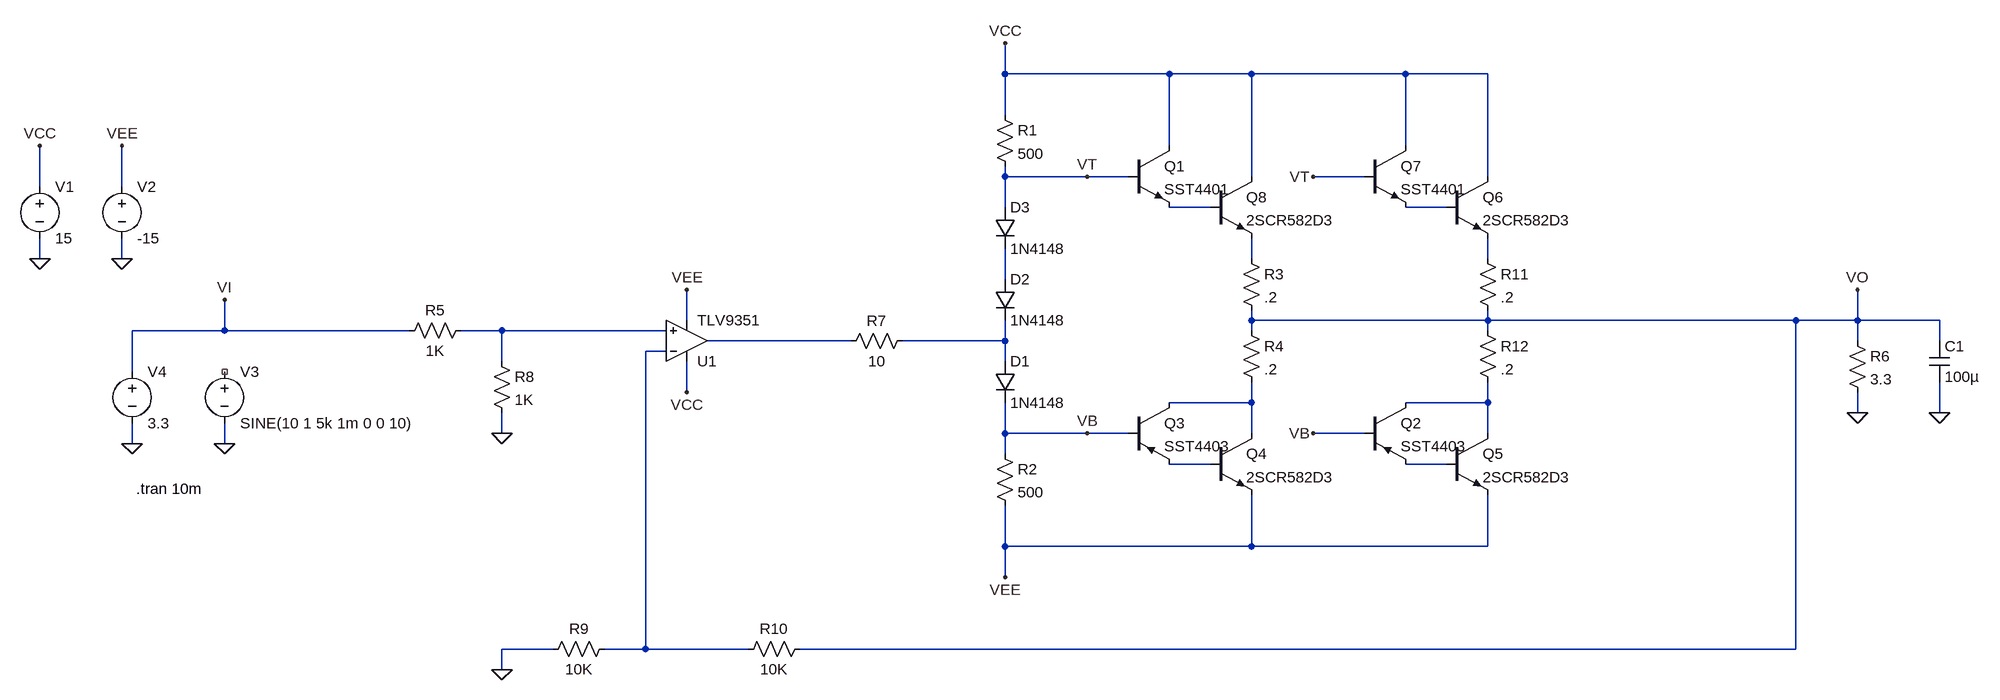
[diagram p0: schematic NOT_USED_Current Amp-PowerAmp.asc]
NOT_USED_Current Amp-PowerAmp.asc, the LTspice schematic file:
Version 4
SHEET 1 2168 740
WIRE 640 -208 640 -256
WIRE 896 -208 640 -208
WIRE 1024 -208 896 -208
WIRE 1264 -208 1024 -208
WIRE 1392 -208 1264 -208
WIRE 640 -144 640 -208
WIRE 896 -96 896 -208
WIRE 1264 -96 1264 -208
WIRE 640 -48 640 -64
WIRE 768 -48 640 -48
WIRE 832 -48 768 -48
WIRE 1024 -48 1024 -208
WIRE 1200 -48 1120 -48
WIRE 1392 -48 1392 -208
WIRE -864 -32 -864 -96
WIRE -736 -32 -736 -96
WIRE 640 0 640 -48
WIRE 960 0 896 0
WIRE 1328 0 1264 0
WIRE -864 80 -864 48
WIRE -736 80 -736 48
WIRE 1024 80 1024 48
WIRE 1392 80 1392 48
WIRE 640 112 640 64
WIRE 144 176 144 128
WIRE 1024 176 1024 160
WIRE 1392 176 1392 160
WIRE 1392 176 1024 176
WIRE 1872 176 1392 176
WIRE 1968 176 1968 128
WIRE 1968 176 1872 176
WIRE 2096 176 1968 176
WIRE -576 192 -576 144
WIRE -576 192 -720 192
WIRE -288 192 -576 192
WIRE -144 192 -208 192
WIRE 112 192 -144 192
WIRE 1024 192 1024 176
WIRE 1392 192 1392 176
WIRE 400 208 176 208
WIRE 640 208 640 176
WIRE 640 208 480 208
WIRE 1968 208 1968 176
WIRE 2096 208 2096 176
WIRE 112 224 80 224
WIRE -144 240 -144 192
WIRE 640 240 640 208
WIRE -720 256 -720 192
WIRE 144 288 144 240
WIRE 1024 304 1024 272
WIRE 1024 304 896 304
WIRE 1392 304 1392 272
WIRE 1392 304 1264 304
WIRE 1968 320 1968 288
WIRE 2096 320 2096 272
WIRE -144 352 -144 320
WIRE 640 352 640 304
WIRE 768 352 640 352
WIRE 832 352 768 352
WIRE 1024 352 1024 304
WIRE 1200 352 1120 352
WIRE 1392 352 1392 304
WIRE -720 368 -720 336
WIRE -576 368 -576 336
WIRE 640 384 640 352
WIRE 960 400 896 400
WIRE 1328 400 1264 400
WIRE 640 528 640 464
WIRE 1024 528 1024 448
WIRE 1024 528 640 528
WIRE 1392 528 1392 448
WIRE 1392 528 1024 528
WIRE 640 576 640 528
WIRE -64 688 -144 688
WIRE 80 688 80 224
WIRE 80 688 16 688
WIRE 240 688 80 688
WIRE 1872 688 1872 176
WIRE 1872 688 320 688
WIRE -144 720 -144 688
FLAG -864 80 0
FLAG -736 80 0
FLAG -864 -96 VCC
FLAG -736 -96 VEE
FLAG -720 368 0
FLAG -576 368 0
FLAG 640 -256 VCC
FLAG 640 576 VEE
FLAG 1968 320 0
FLAG 1968 128 VO
FLAG 144 128 VEE
FLAG 144 288 VCC
FLAG 2096 320 0
FLAG -576 144 VI
FLAG -144 352 0
FLAG -144 720 0
FLAG 1120 -48 VT
FLAG 768 -48 VT
FLAG 1120 352 VB
FLAG 768 352 VB
SYMBOL Hab_OpAmp\\TLV9351 144 272 M180
SYMATTR InstName U1
SYMBOL voltage -864 -48 R0
WINDOW 123 0 0 Left 0
WINDOW 39 0 0 Left 0
SYMATTR InstName V1
SYMATTR Value 15
SYMBOL voltage -736 -48 R0
WINDOW 123 0 0 Left 0
WINDOW 39 0 0 Left 0
SYMATTR InstName V2
SYMATTR Value -15
SYMBOL diode 624 240 R0
SYMATTR InstName D1
SYMATTR Value 1N4148
SYMBOL diode 624 112 R0
SYMATTR InstName D2
SYMATTR Value 1N4148
SYMBOL diode 624 0 R0
SYMATTR InstName D3
SYMATTR Value 1N4148
SYMBOL pnp 832 304 R0
SYMATTR InstName Q3
SYMATTR Value SST4403
SYMBOL npn 960 352 R0
SYMATTR InstName Q4
SYMATTR Value 2SCR582D3
SYMBOL res 624 -160 R0
SYMATTR InstName R1
SYMATTR Value 500
SYMBOL res 624 368 R0
SYMATTR InstName R2
SYMATTR Value 500
SYMBOL res 1008 64 R0
SYMATTR InstName R3
SYMATTR Value .2
SYMBOL res 1008 176 R0
SYMATTR InstName R4
SYMATTR Value .2
SYMBOL res -192 176 R90
WINDOW 0 0 56 VBottom 2
WINDOW 3 32 56 VTop 2
SYMATTR InstName R5
SYMATTR Value 1K
SYMBOL voltage -576 240 R0
WINDOW 123 0 0 Left 0
WINDOW 39 0 0 Left 0
SYMATTR InstName V3
SYMATTR Value SINE(10 1 5k 1m 0 0 10)
SYMBOL voltage -720 240 R0
WINDOW 123 0 0 Left 0
WINDOW 39 0 0 Left 0
SYMATTR InstName V4
SYMATTR Value 3.3
SYMBOL res 1952 192 R0
SYMATTR InstName R6
SYMATTR Value 3.3
SYMBOL cap 2080 208 R0
SYMATTR InstName C1
SYMATTR Value 100µ
SYMBOL res 496 192 R90
WINDOW 0 0 56 VBottom 2
WINDOW 3 32 56 VTop 2
SYMATTR InstName R7
SYMATTR Value 10
SYMBOL npn 960 -48 R0
SYMATTR InstName Q8
SYMATTR Value 2SCR582D3
SYMBOL npn 832 -96 R0
SYMATTR InstName Q1
SYMATTR Value SST4401
SYMBOL res -160 224 R0
SYMATTR InstName R8
SYMATTR Value 1K
SYMBOL res 32 672 R90
WINDOW 0 0 56 VBottom 2
WINDOW 3 32 56 VTop 2
SYMATTR InstName R9
SYMATTR Value 10K
SYMBOL res 336 672 R90
WINDOW 0 0 56 VBottom 2
WINDOW 3 32 56 VTop 2
SYMATTR InstName R10
SYMATTR Value 10K
SYMBOL pnp 1200 304 R0
SYMATTR InstName Q2
SYMATTR Value SST4403
SYMBOL npn 1328 352 R0
SYMATTR InstName Q5
SYMATTR Value 2SCR582D3
SYMBOL res 1376 64 R0
SYMATTR InstName R11
SYMATTR Value .2
SYMBOL res 1376 176 R0
SYMATTR InstName R12
SYMATTR Value .2
SYMBOL npn 1328 -48 R0
SYMATTR InstName Q6
SYMATTR Value 2SCR582D3
SYMBOL npn 1200 -96 R0
SYMATTR InstName Q7
SYMATTR Value SST4401
TEXT -714 438 Left 2 !.tran 10m

The netlist it stands for:
* NOT_USED_Current Amp-PowerAmp.asc
* U1: TLV9351 (symbol Hab_OpAmp\TLV9351 not available, pins judged from their places): In+=N006 In-=N009 V+=VCC V-=VEE OUT=N007
V1 VCC 0 15
V2 VEE 0 -15
D1 N008 VB 1N4148
D2 N005 N008 1N4148
D3 VT N005 1N4148
Q3 N010 VB N012 0 SST4403
Q4 N010 N012 VEE 0 2SCR582D3
R1 VCC VT 500
R2 VB VEE 500
R3 N003 VO .2
R4 VO N010 .2
R5 N006 VI 1K
V3 NC_01 0 SINE(10 1 5k 1m 0 0 10)
V4 VI 0 3.3
R6 VO 0 3.3
C1 VO 0 100µ
R7 N008 N007 10
Q8 VCC N001 N003 0 2SCR582D3
Q1 VCC VT N001 0 SST4401
R8 N006 0 1K
R9 N009 0 10K
R10 VO N009 10K
Q2 N011 VB N013 0 SST4403
Q5 N011 N013 VEE 0 2SCR582D3
R11 N004 VO .2
R12 VO N011 .2
Q6 VCC N002 N004 0 2SCR582D3
Q7 VCC VT N002 0 SST4401
.model D D
.lib standard.dio
.model NPN NPN
.model PNP PNP
.lib standard.bjt
.tran 10m
.backanno
.end